# Altium schematic sheet ZHSD-ZYNQ-MIO.SchDoc
size 420 x 297 mm; DocumentNumber: 8; SheetNumber: 8; SheetTotal: 17; Size: A3
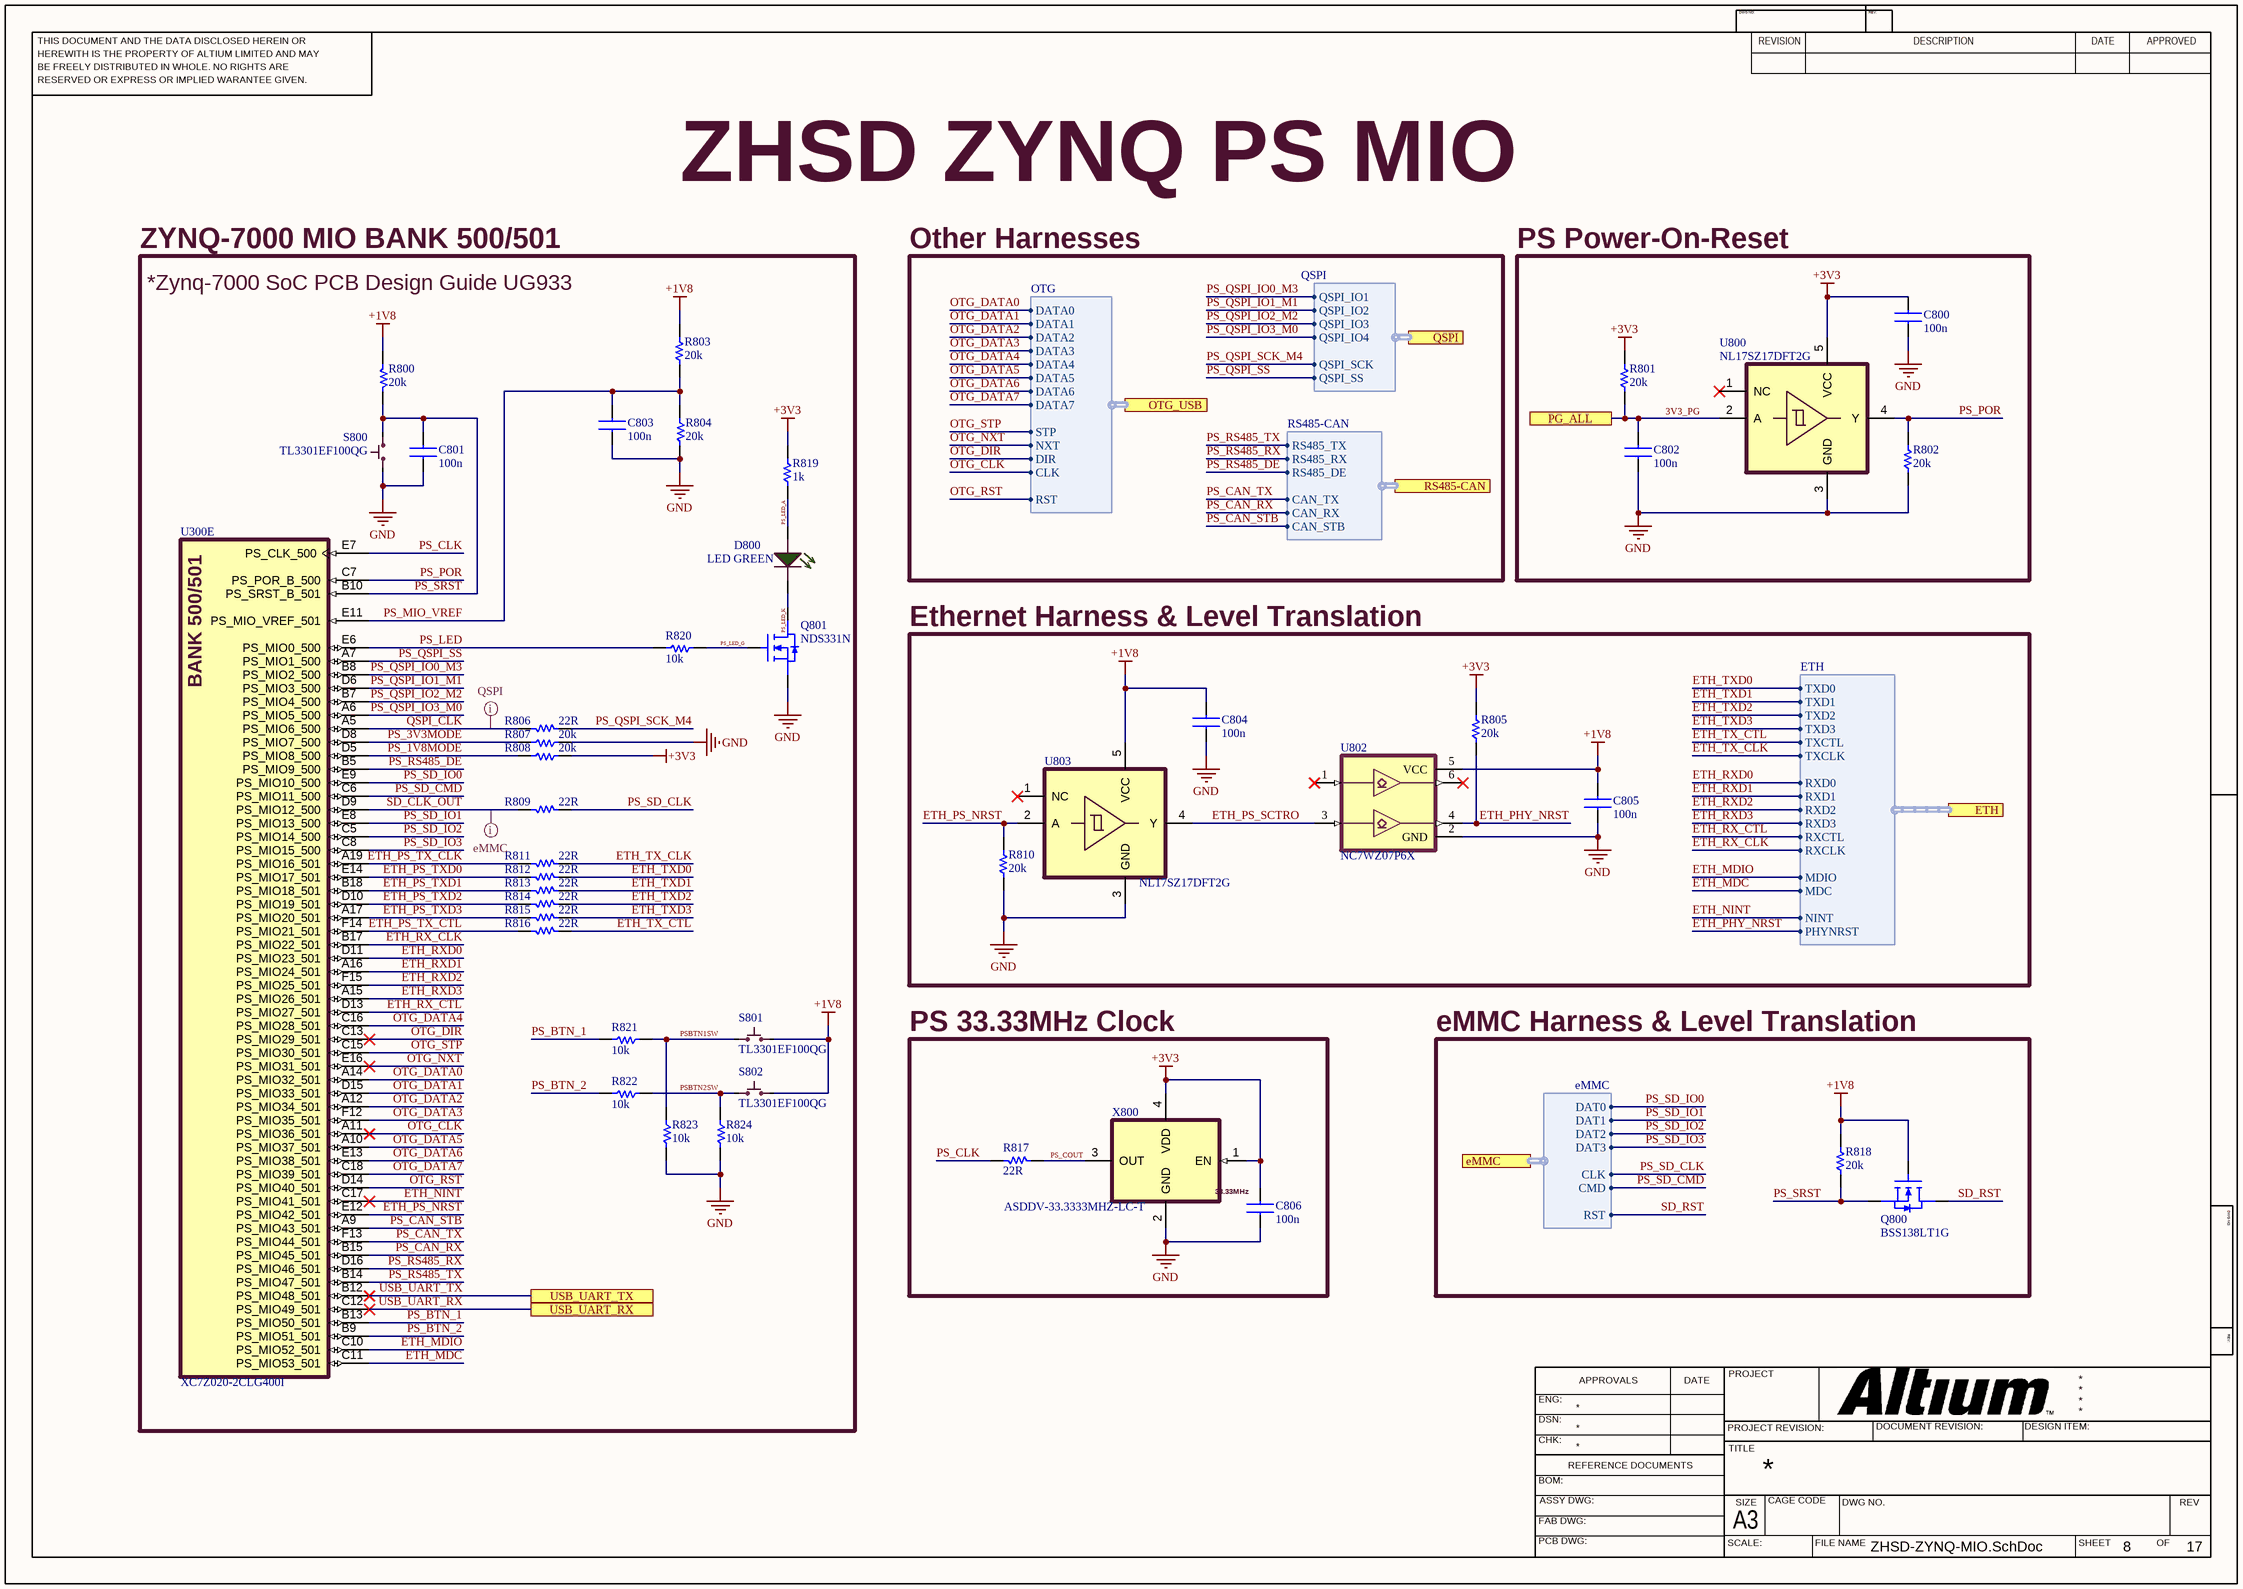
[diagram p0: ZHSD-ZYNQ-MIO.SchDoc]

## Parts
C800  100n  [0603CAPC1608X09N]
C801  100n  [0603CAPC1608X09N]
C802  100n  [0603CAPC1608X09N]
C803  100n  [0603CAPC1608X09N]
C804  100n  [0603CAPC1608X09N]
C805  100n  [0603CAPC1608X09N]
C806  100n  [0603CAPC1608X09N]
D800  LED GREEN  [0603_LED_1608N]
Q800  BSS138LT1G  [SOT95P237X89-3N]
Q801  NDS331N  [SOT95P251X112-3N]
R800  20k  [0402RESC1005X04N]
R801  20k  [0402RESC1005X04N]
R802  20k  [0402RESC1005X04N]
R803  20k  [0402RESC1005X04N]
R804  20k  [0402RESC1005X04N]
R805  20k  [0402RESC1005X04N]
R806  22R  [0603RESC1608X05N]
R807  20k  [0402RESC1005X04N]
R808  20k  [0402RESC1005X04N]
R809  22R  [0603RESC1608X05N]
R810  20k  [0402RESC1005X04N]
R811  22R  [0603RESC1608X05N]
R812  22R  [0603RESC1608X05N]
R813  22R  [0603RESC1608X05N]
R814  22R  [0603RESC1608X05N]
R815  22R  [0603RESC1608X05N]
R816  22R  [0603RESC1608X05N]
R817  22R  [0603RESC1608X05N]
R818  20k  [0402RESC1005X04N]
R819  1k  [0402RESC1005X04N]
R820  10k  [0603RESC1608X05N]
R821  10k  [0603RESC1608X05N]
R822  10k  [0603RESC1608X05N]
R823  10k  [0603RESC1608X05N]
R824  10k  [0603RESC1608X05N]
S800  TL3301EF100QG  [TL3301_Tact_SW]
S801  TL3301EF100QG  [TL3301_Tact_SW]
S802  TL3301EF100QG  [TL3301_Tact_SW]
U300  XC7Z020-2CLG400I  [BGA400C80P20X20_1700X1700X147]  (part E of 8)
U800  NL17SZ17DFT2G  [SOT65P210X110-5N]
U802  NC7WZ07P6X  [NC7WZ07]
U803  NL17SZ17DFT2G  [SOT65P210X110-5N]
X800  ASDDV-33.3333MHZ-LC-T  [XTAL_2520]

## Blocks framed on the sheet
ZYNQ-7000 MIO BANK 500/501: C801 C803 D800 Q801 R800 R803 R804 R806-R809 R811-R816 R819-R824 S800-S802 U300
PS Power-On-Reset: C800 C802 R801 R802 U800
Ethernet Harness & Level Translation: C804 C805 R805 R810 U802 U803
PS 33.33MHz Clock: C806 R817 X800
eMMC Harness & Level Translation: Q800 R818

## Ports
eMMC (harness eMMC, see ZHSD-Block[253.5,149.98], ZHSD-BOOT-STORAGE[195.58,144.78]), ETH (harness ETH, see ZHSD-Block[174.76,116.96], ZHSD-ETHERNET[43.18,203.2]), OTG_USB (harness OTG, see ZHSD-Block[174.76,149.98], ZHSD-USB-OTG[27.903,180.34]), PG_ALL (see ZHSD-Block[174.76,177.92], ZHSD-POWER[28.56,47.02]), QSPI (harness QSPI, see ZHSD-Block[253.5,167.76], ZHSD-BOOT-STORAGE[22.86,76.2]), RS485-CAN (harness RS485-CAN, see ZHSD-Block[174.76,132.2], ZHSD-RS485-CAN[256.54,58.42]), USB_UART_RX (see ZHSD-Block[174.76,167.76], ZHSD-USB-UART[251.46,99.06]), USB_UART_TX (see ZHSD-Block[174.76,172.84], ZHSD-USB-UART[251.46,55.88])

## Harnesses
QSPI: QSPI_IO1, QSPI_IO2, QSPI_IO3, QSPI_IO4, QSPI_SCK, QSPI_SS
eMMC: DAT0, DAT1, DAT2, DAT3, CLK, CMD, RST
OTG: DATA0, DATA1, DATA2, DATA3, DATA4, DATA5, DATA6, DATA7, STP, NXT, DIR, CLK, RST
ETH: TXCLK, TXD0, TXD1, TXD2, TXD3, TXCTL, RXCLK, RXD0, RXD1, RXD2, RXD3, RXCTL, MDIO, MDC, NINT, PHYNRST
RS485-CAN: RS485_TX, RS485_RX, RS485_DE, CAN_TX, CAN_RX, CAN_STB

## Nets
+1V8: C804.2 C805.2 Q800.1(G) R800.2 R803.2 R818.2 S801.3,4 S802.3,4 U802.5(VCC) U803.5(VCC)
+3V3: C800.2 C806.2 R801.2 R805.2 R808.1 R819.2 U800.5(VCC) X800.1(EN) X800.4(VDD)
GND: C800.1 C801.1 C802.1 C803.2 C804.1 C805.1 C806.1 Q801.2(S) R802.1 R804.2 R807.1 R810.1 R823.2 R824.2 S800.1,2 U800.3(GND) U802.2(GND) U803.3(GND) X800.2(GND)
3V3_PG: C802.2 R801.1 U800.2(A) ; port PG_ALL
ETH_MDC: U300.C11(PS_MIO53_501) ; port ETH.MDC
ETH_MDIO: U300.C10(PS_MIO52_501) ; port ETH.MDIO
ETH_NINT: U300.C17(PS_MIO41_501) ; port ETH.NINT
ETH_PHY_NRST: R805.1 U802.4(Y2) ; port ETH.PHYNRST
ETH_PS_NRST: R810.2 U300.E12(PS_MIO42_501) U803.2(A)
ETH_PS_SCTRO: U802.3(A2) U803.4(Y)
ETH_PS_TX_CLK: R811.2 U300.A19(PS_MIO16_501)
ETH_PS_TX_CTL: R816.2 U300.F14(PS_MIO21_501)
ETH_PS_TXD0: R812.2 U300.E14(PS_MIO17_501)
ETH_PS_TXD1: R813.2 U300.B18(PS_MIO18_501)
ETH_PS_TXD2: R814.2 U300.D10(PS_MIO19_501)
ETH_PS_TXD3: R815.2 U300.A17(PS_MIO20_501)
ETH_RX_CLK: U300.B17(PS_MIO22_501) ; port ETH.RXCLK
ETH_RX_CTL: U300.D13(PS_MIO27_501) ; port ETH.RXCTL
ETH_RXD0: U300.D11(PS_MIO23_501) ; port ETH.RXD0
ETH_RXD1: U300.A16(PS_MIO24_501) ; port ETH.RXD1
ETH_RXD2: U300.F15(PS_MIO25_501) ; port ETH.RXD2
ETH_RXD3: U300.A15(PS_MIO26_501) ; port ETH.RXD3
ETH_TX_CLK: R811.1 ; port ETH.TXCLK
ETH_TX_CTL: R816.1 ; port ETH.TXCTL
ETH_TXD0: R812.1 ; port ETH.TXD0
ETH_TXD1: R813.1 ; port ETH.TXD1
ETH_TXD2: R814.1 ; port ETH.TXD2
ETH_TXD3: R815.1 ; port ETH.TXD3
OTG_CLK: U300.A11(PS_MIO36_501) ; port OTG_USB.CLK
OTG_DATA0: U300.A14(PS_MIO32_501) ; port OTG_USB.DATA0
OTG_DATA1: U300.D15(PS_MIO33_501) ; port OTG_USB.DATA1
OTG_DATA2: U300.A12(PS_MIO34_501) ; port OTG_USB.DATA2
OTG_DATA3: U300.F12(PS_MIO35_501) ; port OTG_USB.DATA3
OTG_DATA4: U300.C16(PS_MIO28_501) ; port OTG_USB.DATA4
OTG_DATA5: U300.A10(PS_MIO37_501) ; port OTG_USB.DATA5
OTG_DATA6: U300.E13(PS_MIO38_501) ; port OTG_USB.DATA6
OTG_DATA7: U300.C18(PS_MIO39_501) ; port OTG_USB.DATA7
OTG_DIR: U300.C13(PS_MIO29_501) ; port OTG_USB.DIR
OTG_NXT: U300.E16(PS_MIO31_501) ; port OTG_USB.NXT
OTG_RST: U300.D14(PS_MIO40_501) ; port OTG_USB.RST
OTG_STP: U300.C15(PS_MIO30_501) ; port OTG_USB.STP
PS_1V8MODE: R808.2 U300.D5(PS_MIO8_500)
PS_3V3MODE: R807.2 U300.D8(PS_MIO7_500)
PS_BTN_1: R821.2 U300.B13(PS_MIO50_501)
PS_BTN_2: R822.2 U300.B9(PS_MIO51_501)
PS_CAN_RX: U300.B15(PS_MIO45_501) ; port RS485-CAN.CAN_RX
PS_CAN_STB: U300.A9(PS_MIO43_501) ; port RS485-CAN.CAN_STB
PS_CAN_TX: U300.F13(PS_MIO44_501) ; port RS485-CAN.CAN_TX
PS_CLK: R817.2 U300.E7(PS_CLK_500)
PS_COUT: R817.1 X800.3(OUT)
PS_LED: R820.2 U300.E6(PS_MIO0_500)
PS_LED_A: D800.1(A) R819.1
PS_LED_G: Q801.1(G) R820.1
PS_LED_K: D800.2(C) Q801.3(D)
PS_MIO_VREF: C803.1 R803.1 R804.1 U300.E11(PS_MIO_VREF_501)
PS_POR: R802.2 U300.C7(PS_POR_B_500) U800.4(Y)
PS_QSPI_IO0_M3: U300.B8(PS_MIO2_500) ; port QSPI.QSPI_IO1
PS_QSPI_IO1_M1: U300.D6(PS_MIO3_500) ; port QSPI.QSPI_IO2
PS_QSPI_IO2_M2: U300.B7(PS_MIO4_500) ; port QSPI.QSPI_IO3
PS_QSPI_IO3_M0: U300.A6(PS_MIO5_500) ; port QSPI.QSPI_IO4
PS_QSPI_SCK_M4: R806.1 ; port QSPI.QSPI_SCK
PS_QSPI_SS: U300.A7(PS_MIO1_500) ; port QSPI.QSPI_SS
PS_RS485_DE: U300.B5(PS_MIO9_500) ; port RS485-CAN.RS485_DE
PS_RS485_RX: U300.D16(PS_MIO46_501) ; port RS485-CAN.RS485_RX
PS_RS485_TX: U300.B14(PS_MIO47_501) ; port RS485-CAN.RS485_TX
PS_SD_CLK: R809.1 ; port eMMC.CLK
PS_SD_CMD: U300.C6(PS_MIO11_500) ; port eMMC.CMD
PS_SD_IO0: U300.E9(PS_MIO10_500) ; port eMMC.DAT0
PS_SD_IO1: U300.E8(PS_MIO13_500) ; port eMMC.DAT1
PS_SD_IO2: U300.C5(PS_MIO14_500) ; port eMMC.DAT2
PS_SD_IO3: U300.C8(PS_MIO15_500) ; port eMMC.DAT3
PS_SRST: C801.2 Q800.2(S) R800.1 R818.1 S800.3,4 U300.B10(PS_SRST_B_501)
PSBTN1SW: R821.1 R823.1 S801.1,2
PSBTN2SW: R822.1 R824.1 S802.1,2
QSPI_CLK: R806.2 U300.A5(PS_MIO6_500)
SD_CLK_OUT: R809.2 U300.D9(PS_MIO12_500)
SD_RST: Q800.3(D) ; port eMMC.RST
USB_UART_RX: U300.C12(PS_MIO49_501) ; port USB_UART_RX
USB_UART_TX: U300.B12(PS_MIO48_501) ; port USB_UART_TX

Not connected (* = marked no-connect by the designer): U800 1(NC)*; U802 1(A1)* 6(Y1)*; U803 1(NC)*

## Layout directives
net class eMMC; rule Matched Net Lengths [Delay Tolerance = 50ps]: SD_CLK_OUT
rule Matched Net Lengths [Delay Tolerance = 50ps]; net class QSPI: QSPI_CLK

## Notes on the sheet
- ZHSD ZYNQ PS MIO
- Other Harnesses
- *Zynq-7000 SoC PCB Design Guide UG933
- THIS DOCUMENT AND THE DATA DISCLOSED HEREIN OR
- HEREWITH IS THE PROPERTY OF ALTIUM LIMITED AND MAY
- DWG NO:
- REVISION
- REV:
- DESCRIPTION
- DATE
- APPROVED
- BE FREELY DISTRIBUTED IN WHOLE. NO RIGHTS ARE
- RESERVED OR EXPRESS OR IMPLIED WARANTEE GIVEN.
- ENG:
- APPROVALS
- PROJECT
- DSN:
- CHK:
- REFERENCE DOCUMENTS
- PROJECT REVISION:
- TITLE
- DOCUMENT REVISION:
- DESIGN ITEM:
- BOM:
- FAB DWG:
- PCB DWG:
- ASSY DWG:
- SCALE:
- A3
- SIZE
- CAGE CODE
- FILE NAME
- DWG NO.
- SHEET
- OF
- REV
- (in symbol ASDDV-33.3333MHZ-LC-T) 33.33MHz
- (in symbol XC7Z020-2CLG400I, part E) BANK 500/501

## Library data of the parts
C800-C806 = GRM155R71C104KA88J: CAP CER 0.1UF 16V X7R 0402 (1005) ±10%; Manufacturer: Murata Electronics; Value: 0.1 µF; ComponentLink1Description: Datasheet; ComponentLink1URL: https://search.murata.co.jp/Ceramy/image/img/A01X/G101/ENG/GRM155R71C104KA88-01.pdf; MPN: GRM155R71C104KA88J; Package: 0402; Tolerance: ±10%; Voltage: 16V
D800 = LTST-C191TGKT: LED GREEN CLEAR CHIP SMD; Manufacturer: Lite-On Inc.; ComponentLink1Description: Datasheet; ComponentLink1URL: https://optoelectronics.liteon.com/upload/download/DS22-2000-300/LTST-C191TGKT.PDF; MPN: LTST-C191TGKT; Package: 0603
Q800 = BSS138LT1G: N-Channel 50 V 200mA (Ta) 225mW (Ta) Surface Mount SOT-23-3 (TO-236); Manufacturer: onsemi; Drain to Source Voltage (Vdss): 50 V; Rds On (Max) @ Id, Vgs: 3.5Ohm @ 200mA, 5V; Vgs (Max): ±20V; ComponentLink1Description: Datasheet; ComponentLink1URL: https://www.onsemi.com/pdf/datasheet/bss138lt1-d.pdf; MPN: BSS138LT1G; Package: SOT-23-3
Q801 = NDS331N: N-Channel 20 V 1.3A (Ta) 500mW (Ta) Surface Mount SOT-23-3; Manufacturer: onsemi; Drain to Source Voltage (Vdss): 20 V; Rds On (Max) @ Id, Vgs: 160mOhm @ 1.5A, 4.5V; Vgs (Max): ±8V; ComponentLink1Description: Datasheet; ComponentLink1URL: https://www.onsemi.com/pdf/datasheet/nds331n-d.pdf; MPN: NDS331N; Package: SOT-23-3
R800-R805 R807 R808 R810 R818 = RC0402FR-0720KL: RES 20K OHM 1% 1/16W 0402 (1005); Manufacturer: YAGEO; Value: 20 kOhms; Voltage: 50V; ComponentLink1Description: Datasheet; ComponentLink1URL: https://yageogroup.com/content/datasheet/asset/file/PYU-RT_1-TO-0-01_ROHS_L; MPN: RC0402FR-0720KL; Tolerance: ±1%; Package: 0402
R806 R809 R811-R817 = RC0603FR-0722RL: RES 22 OHM 1% 1/10W 0603 (1608); Manufacturer: YAGEO; Value: 22 Ohms; Voltage: 75V; ComponentLink1Description: Datasheet; ComponentLink1URL: https://yageogroup.com/content/datasheet/asset/file/PYU-RC_GROUP_51_ROHS_L; MPN: RC0603FR-0722RL; Tolerance: ±1%; Package: 0603
R819 = RC0402JR-071KL: RES 1K OHM 5% 1/16W 0402 (1005); Manufacturer: YAGEO; Value: 1 kOhms; Voltage: 50V; ComponentLink1Description: Datasheet; ComponentLink1URL: https://yageogroup.com/content/datasheet/asset/file/PYU-RT_1-TO-0-01_ROHS_L; MPN: RC0402JR-071KL; Tolerance: ±5%; Package: 0402
R820-R824 = RC0603FR-0710KL: RES 10K OHM 1% 1/10W 0603(1608); Manufacturer: YAGEO; Value: 10 kOhms; Voltage: 75V; ComponentLink1Description: Datasheet; ComponentLink1URL: https://yageogroup.com/content/datasheet/asset/file/PYU-RC_GROUP_51_ROHS_L; MPN: RC0603FR-0710KL; Tolerance: ±1%; Package: 0603
S800-S802 = TL3301EF100QG: SWITCH TACTILE SPST-NO 0.05A 12V; pin to pad: 1,2>1+2 3,4>3+4; Manufacturer: E-Switch; ComponentLink1Description: Datasheet; ComponentLink1URL: https://configured-product-images.s3.amazonaws.com/Datasheets/TL3301.pdf; MPN: TL3301EF100QG
U300 = XC7Z020-2CLG400I: Dual ARM® Cortex®-A9 MPCore™ with CoreSight™ System On Chip (SOC) IC Zynq®-7000 Artix™-7 FPGA, 85K Logic Cells 766MHz 400-CSPBGA (17x17); Manufacturer: AMD/XILINX; MPN: XC7Z020-2CLG400I; ComponentLink1Description: Datasheet; ComponentLink1URL: https://docs.amd.com/v/u/en-US/ds190-Zynq-7000-Overview; ComponentLink2Description: DC and AC Switching Characteristics; ComponentLink2URL: https://docs.amd.com/v/u/en-US/ds187-XC7Z010-XC7Z020-Data-Sheet; ComponentLink3Description: PCB Design Guide; ComponentLink3URL: https://docs.amd.com/v/u/en-US/ug933-Zynq-7000-PCB; ComponentLink4Description: Packaging and Pinout; ComponentLink4URL: https://docs.amd.com/v/u/en-US/ug865-Zynq-7000-Pkg-Pinout; ComponentLink5Description: Zynq 7000 SoC Technical Reference Manual; ComponentLink5URL: https://docs.amd.com/r/en-US/ug585-zynq-7000-SoC-TRM
U800 U803 = NL17SZ17DFT2G: IC BUFFER NON-INVERT 5.5V SC-88A; Manufacturer: onsemi; ComponentLink1Description: Datasheet; ComponentLink1URL: https://www.onsemi.com/pdf/datasheet/nl17sz17-d.pdf; MPN: NL17SZ17DFT2G
U802 = NC7WZ07P6X: IC BUFFER NON-INVERT 5.5V SC-88; Manufacturer: onsemi; ComponentLink1Description: Datasheet; ComponentLink1URL: https://www.onsemi.com/pdf/datasheet/nc7wz07-d.pdf; MPN: NC7WZ07P6X
X800 = ASDDV-33.3333MHZ-LC-T: 33.3333 MHz XO (Standard) HCMOS, LVCMOS Oscillator 1.6V ~ 3.6V Enable/Disable 4-SMD, No Lead; Manufacturer: Abracon LLC; ComponentLink1Description: Datasheet; ComponentLink1URL: https://abracon.com/datasheets/ASDDV.pdf; MPN: ASDDV-33.3333MHZ-LC-T